# EAGLE schematic FlexPiece_OCTO (EAGLE 9.5.1)
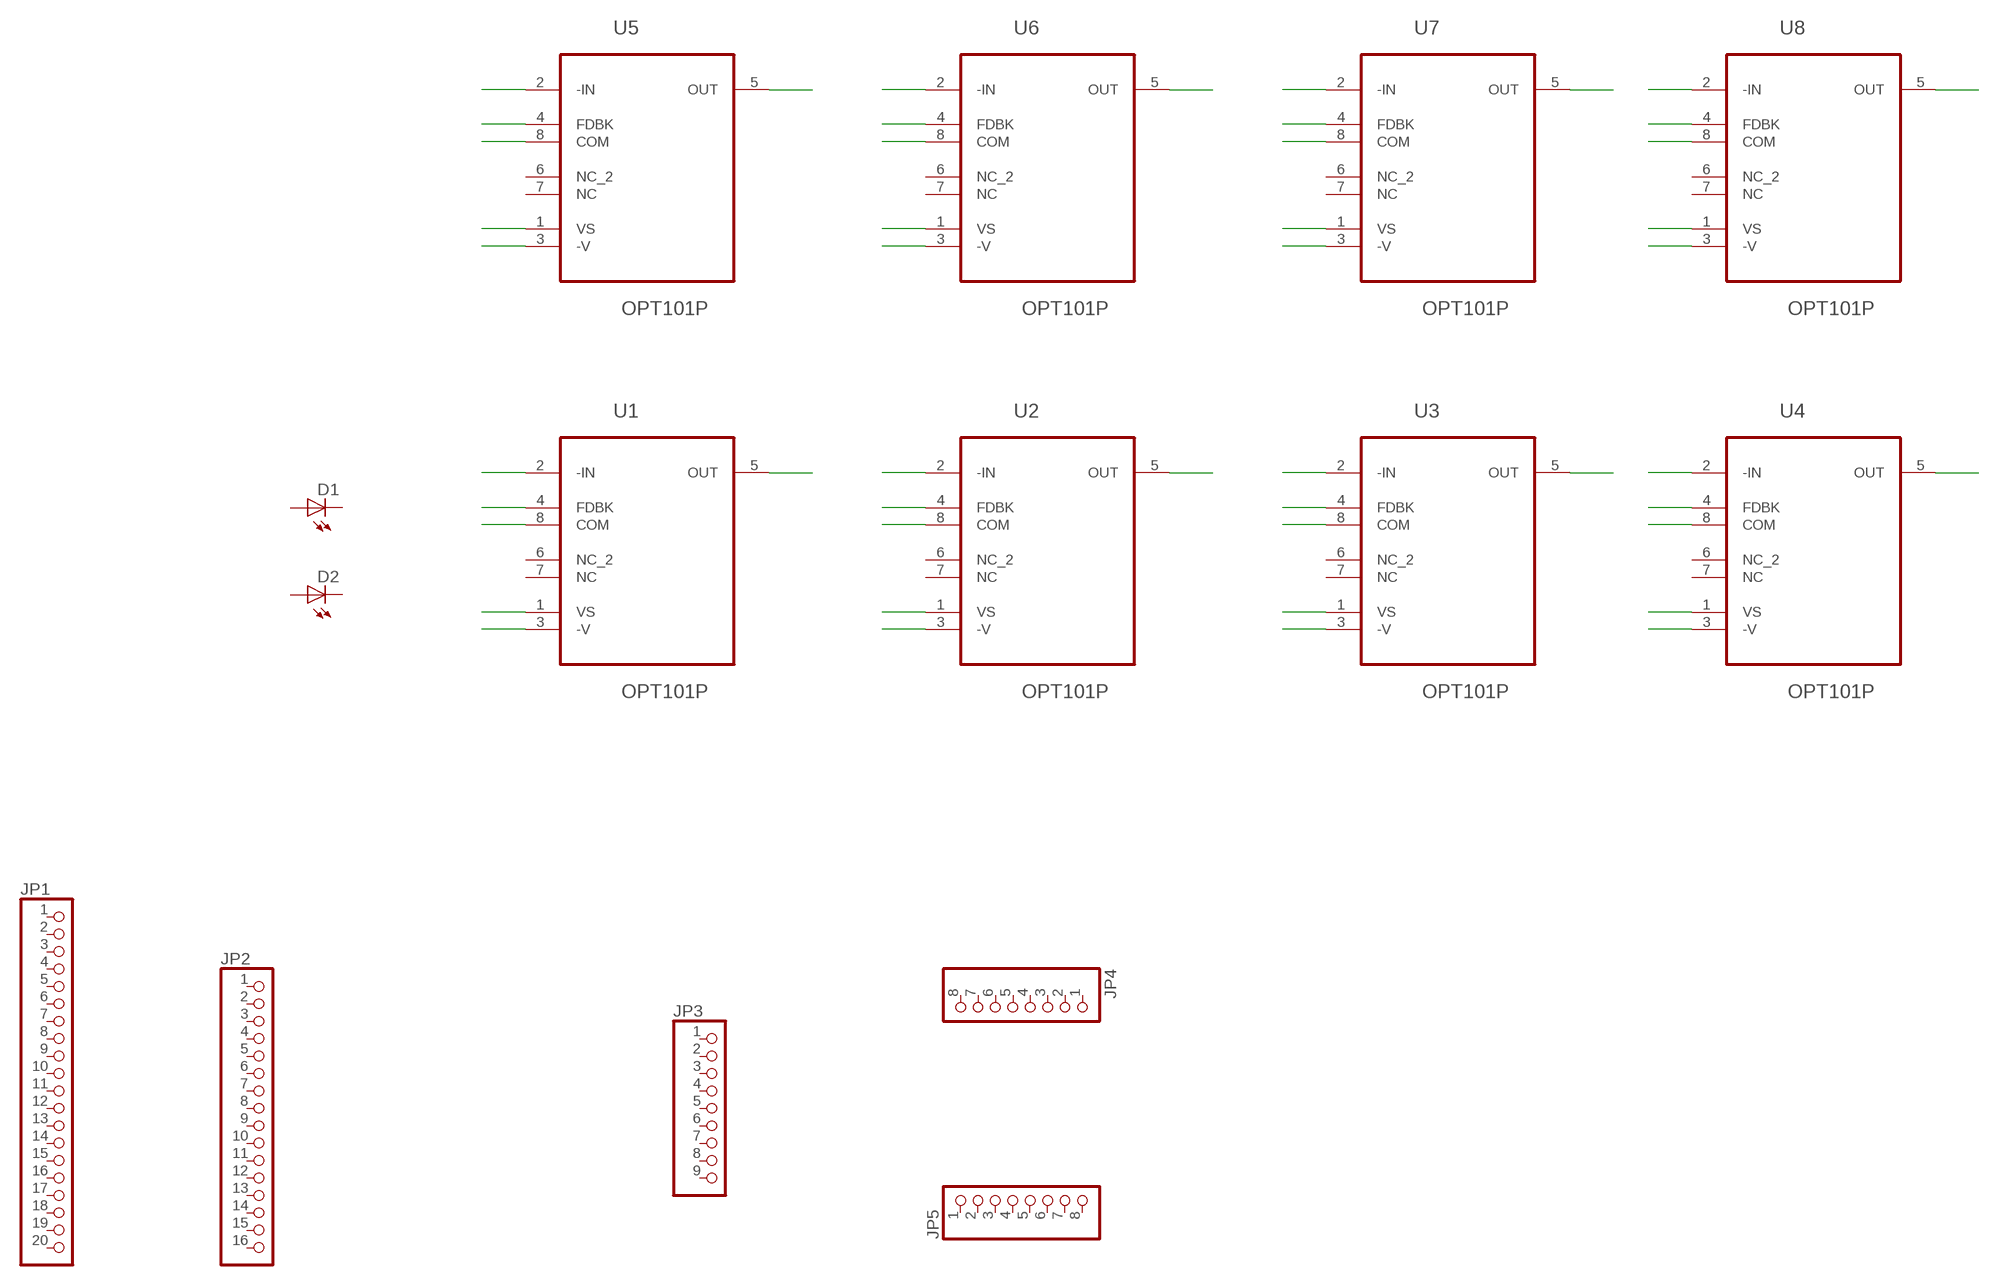
[diagram p0: schematic, sheet 1]

## Parts
D1  LED1206  [LED-1206]
D2  LED1206  [LED-1206]
JP1  PINHD-1X20  [1X20]
JP2  PINHD-1X16  [1X16]
JP3  PINHD-1X9  [1X09]
JP4  PINHD-1X8  [1X08]
JP5  PINHD-1X8  [1X08]
U1  OPT101P  [DIP254P762X419-8]
U2  OPT101P  [DIP254P762X419-8]
U3  OPT101P  [DIP254P762X419-8]
U4  OPT101P  [DIP254P762X419-8]
U5  OPT101P  [DIP254P762X419-8]
U6  OPT101P  [DIP254P762X419-8]
U7  OPT101P  [DIP254P762X419-8]
U8  OPT101P  [DIP254P762X419-8]

## Nets
N$1: U1.2(-IN)
N$2: U1.4(FDBK)
N$3: U1.8(COM)
N$4: U1.1(VS)
N$5: U1.3(-V)
N$6: U1.5(OUT)
N$7: U2.2(-IN)
N$8: U2.4(FDBK)
N$9: U2.8(COM)
N$10: U2.1(VS)
N$11: U2.3(-V)
N$12: U2.5(OUT)
N$13: U3.2(-IN)
N$14: U3.4(FDBK)
N$15: U3.8(COM)
N$16: U3.1(VS)
N$17: U3.3(-V)
N$18: U3.5(OUT)
N$19: U4.2(-IN)
N$20: U4.4(FDBK)
N$21: U4.8(COM)
N$22: U4.1(VS)
N$23: U4.3(-V)
N$24: U4.5(OUT)
N$25: U5.2(-IN)
N$26: U5.4(FDBK)
N$27: U5.8(COM)
N$28: U5.1(VS)
N$29: U5.3(-V)
N$30: U5.5(OUT)
N$31: U6.2(-IN)
N$32: U6.4(FDBK)
N$33: U6.8(COM)
N$34: U6.1(VS)
N$35: U6.3(-V)
N$36: U6.5(OUT)
N$37: U7.2(-IN)
N$38: U7.4(FDBK)
N$39: U7.8(COM)
N$40: U7.1(VS)
N$41: U7.3(-V)
N$42: U7.5(OUT)
N$43: U8.2(-IN)
N$44: U8.4(FDBK)
N$45: U8.8(COM)
N$46: U8.1(VS)
N$47: U8.3(-V)
N$48: U8.5(OUT)
Unconnected: D1.A D1.C D2.A D2.C JP1.1 JP1.2 JP1.3 JP1.4 JP1.5 JP1.6 JP1.7 JP1.8 JP1.9 JP1.10 JP1.11 JP1.12 JP1.13 JP1.14 JP1.15 JP1.16 JP1.17 JP1.18 JP1.19 JP1.20 JP2.1 JP2.2 JP2.3 JP2.4 JP2.5 JP2.6 JP2.7 JP2.8 JP2.9 JP2.10 JP2.11 JP2.12 JP2.13 JP2.14 JP2.15 JP2.16 JP3.1 JP3.2 JP3.3 JP3.4 JP3.5 JP3.6 JP3.7 JP3.8 JP3.9 JP4.1 JP4.2 JP4.3 JP4.4 JP4.5 JP4.6 JP4.7 JP4.8 JP5.1 JP5.2 JP5.3 JP5.4 JP5.5 JP5.6 JP5.7 JP5.8 U1.6(NC_2) U1.7(NC) U2.6(NC_2) U2.7(NC) U3.6(NC_2) U3.7(NC) U4.6(NC_2) U4.7(NC) U5.6(NC_2) U5.7(NC) U6.6(NC_2) U6.7(NC) U7.6(NC_2) U7.7(NC) U8.6(NC_2) U8.7(NC)

## Library data of the parts
D1 D2 = umich:LED: LEDs Standard schematic elements and footprints for 5mm, 3mm, 1206, and 0603 sized LEDs. 5mm - Spark Fun Electronics SKU : COM-00529 (and others)
JP1 = adafruit:PINHD-1X20: PIN HEADER
JP2 = pinhead:PINHD-1X16: PIN HEADER
JP3 = pinhead:PINHD-1X9: PIN HEADER
JP4 JP5 = pinhead:PINHD-1X8: PIN HEADER
U1-U8 = OPT101P:OPT101P: MONOLITHIC PHOTODIODE; AVAILABILITY: Unavailable; DESCRIPTION: Optical Sensor Ambient 650nm Voltage 8-DIP _0.300, 7.62mm_; MF: Texas Instruments; MP: OPT101P; PACKAGE: PDIP-8 Burr Brown; PRICE: None